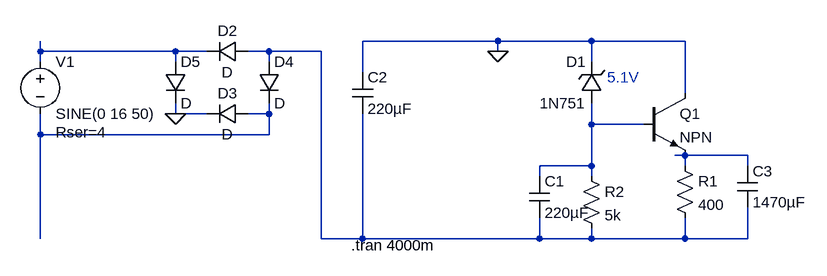
[diagram p0: schematic Draft4.asc]
Draft4.asc, the LTspice schematic file:
Version 4
SHEET 1 880 680
WIRE 160 96 -48 96
WIRE 304 96 160 96
WIRE 448 96 304 96
WIRE -544 112 -544 96
WIRE -336 112 -544 112
WIRE -288 112 -336 112
WIRE -192 112 -224 112
WIRE -112 112 -192 112
WIRE 160 112 160 96
WIRE -544 128 -544 112
WIRE -336 128 -336 112
WIRE -192 128 -192 112
WIRE 304 128 304 96
WIRE -48 144 -48 96
WIRE 448 176 448 96
WIRE -336 208 -336 192
WIRE -288 208 -336 208
WIRE -192 208 -192 192
WIRE -192 208 -224 208
WIRE 304 224 304 192
WIRE 384 224 304 224
WIRE -544 240 -544 208
WIRE -192 240 -192 208
WIRE -192 240 -544 240
WIRE 448 272 432 272
WIRE 544 272 448 272
WIRE 304 288 304 224
WIRE 304 288 224 288
WIRE 448 288 448 272
WIRE 544 288 544 272
WIRE 224 304 224 288
WIRE 304 304 304 288
WIRE -544 400 -544 240
WIRE -112 400 -112 112
WIRE -48 400 -48 208
WIRE -48 400 -112 400
WIRE 224 400 224 368
WIRE 224 400 -48 400
WIRE 304 400 304 384
WIRE 304 400 224 400
WIRE 448 400 448 368
WIRE 448 400 304 400
WIRE 544 400 544 352
WIRE 544 400 448 400
FLAG 160 112 0
FLAG -336 208 0
SYMBOL voltage -544 112 R0
WINDOW 123 0 0 Left 2
WINDOW 39 24 124 Left 2
SYMATTR InstName V1
SYMATTR Value SINE(0 16 50)
SYMATTR SpiceLine Rser=4
SYMBOL npn 384 176 R0
SYMATTR InstName Q1
SYMBOL zener 320 192 R180
WINDOW 0 24 64 Left 2
WINDOW 3 24 0 Left 2
SYMATTR InstName D1
SYMATTR Value 1N751
SYMBOL cap 208 304 R0
SYMATTR InstName C1
SYMATTR Value 220µF
SYMBOL res 432 272 R0
SYMATTR InstName R1
SYMATTR Value 400
SYMBOL res 288 288 R0
SYMATTR InstName R2
SYMATTR Value 5k
SYMBOL cap -64 144 R0
SYMATTR InstName C2
SYMATTR Value 220µF
SYMATTR SpiceLine Rser=0.1
SYMBOL diode -208 128 R0
SYMATTR InstName D4
SYMBOL diode -352 128 R0
SYMATTR InstName D5
SYMBOL diode -224 96 R90
WINDOW 0 0 32 VBottom 2
WINDOW 3 32 32 VTop 2
SYMATTR InstName D2
SYMBOL diode -224 192 R90
WINDOW 0 0 32 VBottom 2
WINDOW 3 32 32 VTop 2
SYMATTR InstName D3
SYMBOL cap 528 288 R0
SYMATTR InstName C3
SYMATTR Value 1470µF
TEXT 328 152 Left 2 ;5.1V
TEXT -66 410 Left 2 !.tran 4000m

The netlist it stands for:
* Draft4.asc
V1 N001 N003 SINE(0 16 50) Rser=4
Q1 0 N004 N005 0 NPN
D1 N004 0 1N751
C1 N004 N002 220µF
R1 N005 N002 400
R2 N004 N002 5k
C2 0 N002 220µF Rser=0.1
D4 N002 N003 D
D5 N001 0 D
D2 N002 N001 D
D3 N003 0 D
C3 N005 N002 1470µF
.model D D
.lib standard.dio
.model NPN NPN
.model PNP PNP
.lib standard.bjt
* 5.1V
.tran 4000m
.backanno
.end